# EAGLE board adapter_board (EAGLE 9.6.2), part 1 of 2
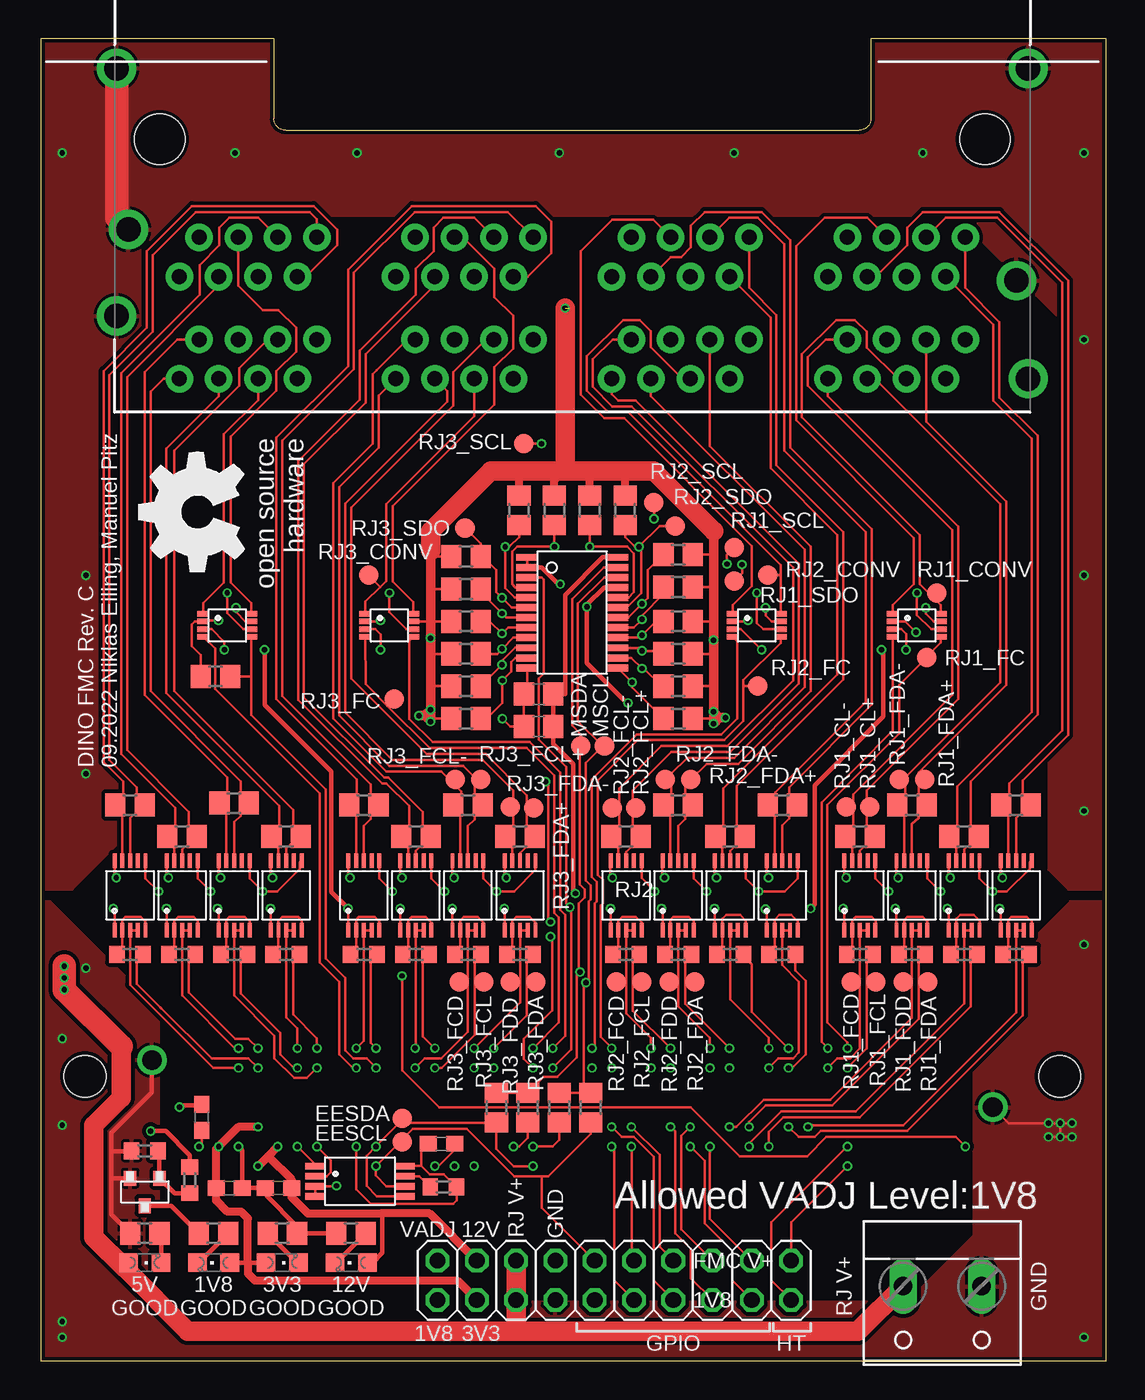
[diagram p6: board, top side]
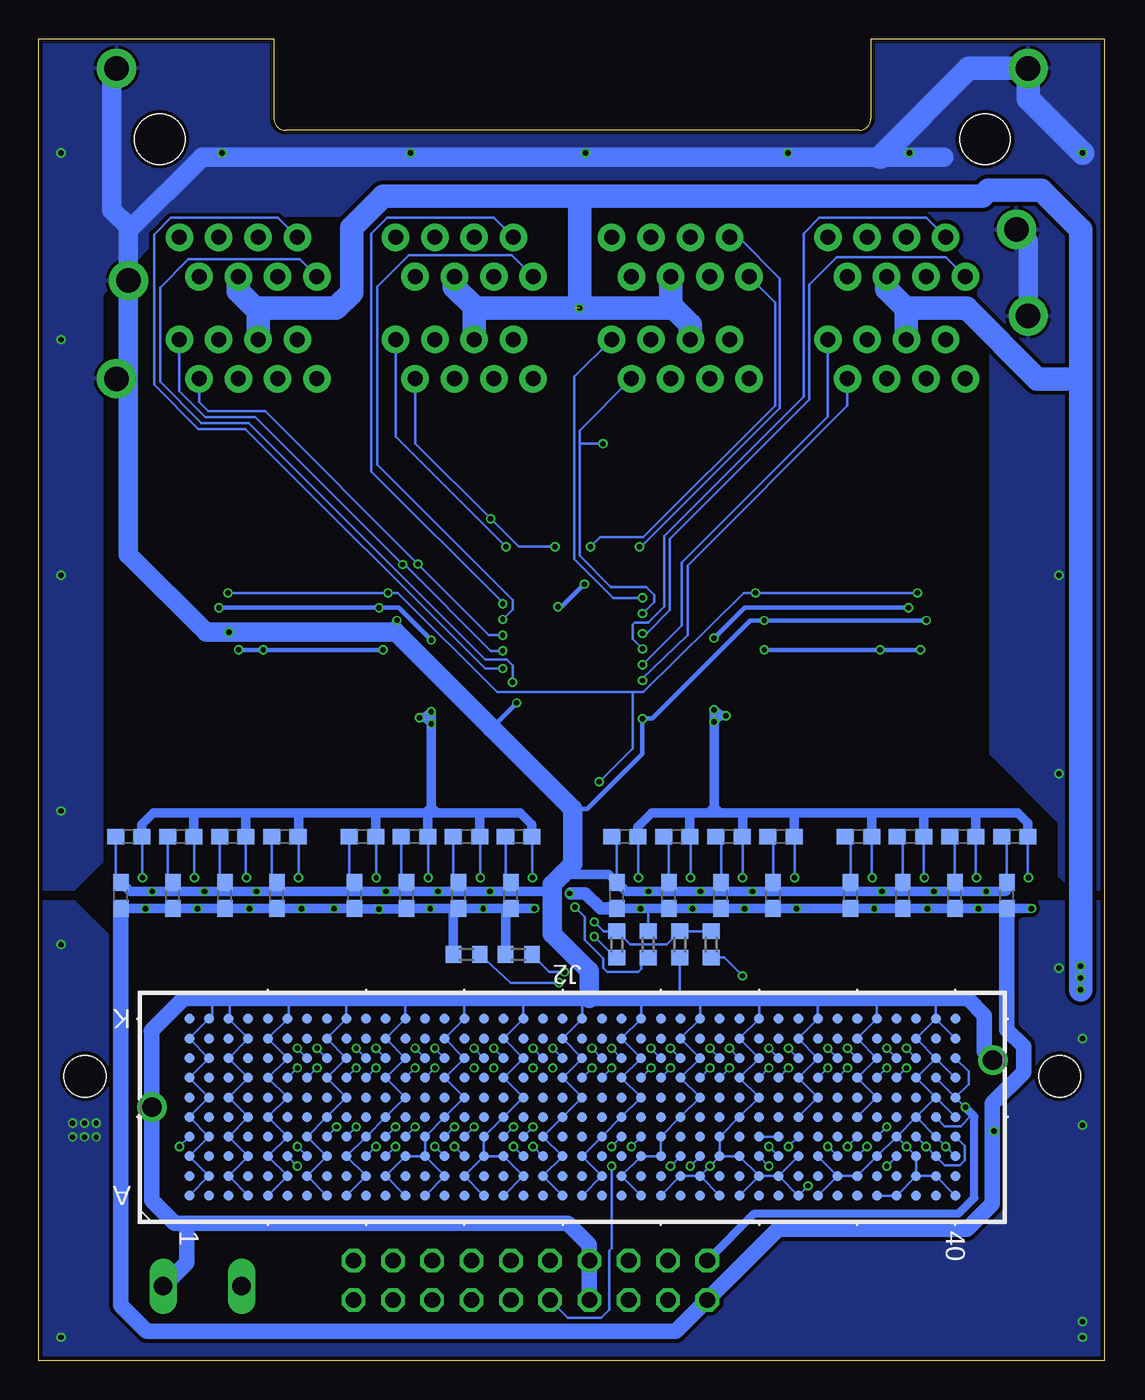
[diagram p7: board, bottom side, seen from below]

Size 68.87 x 85.5 mm. Coordinates in mm from the lower left corner, seen from the top.
Outline: 0,0 68.87,0 68.87,85.5 53.67,85.5 53.67,80.34 arc-90 52.91,79.58 15.83,79.58 arc-90 15.07,80.34 15.07,85.5 0,85.5 0,0
Copper layers (1*16): Top 0.018mm / dielectric 1.55mm / Bottom 0.018mm
Design rules "eC_2Layer_PClass6_BaseCopperO18_eCDefault": minimum track width 0.15mm, minimum drill 0.35mm, track to track 0.15mm, track to pad 0.15mm, pad to pad 0.15mm, via to via 0.15mm, smd to smd 0mil, copper to edge 0.25mm, drill to drill 0.35mm, minimum pad ring 0.175mm, minimum via ring 0.125mm, stop-mask expansion 0mil, vias tented up to drill 0.45mm, thermal gap 0.2mm
Net classes: 3 FPGA: clearance 0.152 mm to class 0, clearance 7.112 mm to class 1, clearance 3.785 mm to class 2, clearance 0.152 mm
Holes 2.7 mm at 2.87,18.4 65.87,18.4

## Footprints (pad centres in the part's own frame; a part is rotated, then mirrored left to right if it is on the bottom)
CHIPLED_0805 = smd 1.2 x 1.2: A 0,-1.05; C 0,1.05
C0603 = smd 1.1 x 1: 1 -0.85,0; 2 0.85,0
C0805 = smd 1.3 x 1.5: 1 -0.95,0; 2 0.95,0
B1,27 = smd 1.27 x 1.27: TP 0,0
TSSOP-8 = smd 1.3 x 0.4: 1 -2.9,0.975; 2 -2.9,0.325; 3 -2.9,-0.325; 4 -2.9,-0.975; 5 2.9,-0.975; 6 2.9,-0.325; 7 2.9,0.325; 8 2.9,0.975
TE_5569262-1 = drill 1.575 pad 2.54: 1 -29.464,15.49; 2 -28.702,9.144; 3 -29.464,-4.572; 4 29.464,11.43; 5 28.702,5.842; 6 29.464,-4.572 | drill 0.97 pad 1.778: 1.1 -16.51,15.49; 1.2 -17.78,12.95; 1.3 -19.05,15.49; 1.4 -20.32,12.95; 1.5 -21.59,15.49; 1.6 -22.86,12.95; 1.8 -25.4,12.95; 2.1 -2.54,15.49; 2.2 -3.81,12.95; 2.3 -5.08,15.49; 2.4 -6.35,12.95; 2.5 -7.62,15.49; 2.6 -8.89,12.95; 2.7 -10.16,15.49; 2.8 -11.43,12.95; 3.1 11.43,15.49; 3.2 10.16,12.95; 3.3 8.89,15.49; 3.4 7.62,12.95; 3.5 6.35,15.49; 3.6 5.08,12.95; 3.7 3.81,15.49; 3.8 2.54,12.95; 4.1 25.4,15.49; 4.2 24.13,12.95; 4.3 22.86,15.49; 4.4 21.59,12.95; 4.5 20.32,15.49; 4.6 19.05,12.95; 4.7 17.78,15.49; 4.8 16.51,12.95; 5.1 -16.51,8.89; 5.2 -17.78,6.35; 5.3 -19.05,8.89; 5.4 -20.32,6.35; 5.5 -21.59,8.89; 5.6 -22.86,6.35; 5.7 -24.13,8.89; 5.8 -25.4,6.35; 6.1 -2.54,8.89; 6.2 -3.81,6.35; 6.3 -5.08,8.89; 6.4 -6.35,6.35; 6.5 -7.62,8.89; 6.6 -8.89,6.35; 6.7 -10.16,8.89; 6.8 -11.43,6.35; 7.1 11.43,8.89; 7.2 10.16,6.35; 7.3 8.89,8.89; 7.4 7.62,6.35; 7.5 6.35,8.89; 7.6 5.08,6.35; 7.7 3.81,8.89; 7.8 2.54,6.35; 8.1 25.4,8.89; 8.2 24.13,6.35; 8.3 22.86,8.89; 8.4 21.59,6.35; 8.5 20.32,8.89; 8.6 19.05,6.35; 8.7 17.78,8.89; 8.8 16.51,6.35 | drill 0.965 pad 1.778: 1.7 -24.13,15.49 | hole 3.251: -26.67,0; 26.67,0
CONN_ASP-134488-01_SAI = drill 1.27 pad 1.27: 401 -27.178,-3.048; 402 27.178,0 | smd 0.635 x 0.635: A1 24.765,5.715; A2 23.495,5.715; A3 22.225,5.715; A4 20.955,5.715; A5 19.685,5.715; A6 18.415,5.715; A7 17.145,5.715; A8 15.875,5.715; A9 14.605,5.715; A10 13.335,5.715; A11 12.065,5.715; A12 10.795,5.715; A13 9.525,5.715; A14 8.255,5.715; A15 6.985,5.715; A16 5.715,5.715; A17 4.445,5.715; A18 3.175,5.715; A19 1.905,5.715; A20 0.635,5.715; A21 -0.635,5.715; A22 -1.905,5.715; A23 -3.175,5.715; A24 -4.445,5.715; A25 -5.715,5.715; A26 -6.985,5.715; A27 -8.255,5.715; A28 -9.525,5.715; A29 -10.795,5.715; A30 -12.065,5.715; A31 -13.335,5.715; A32 -14.605,5.715; A33 -15.875,5.715; A34 -17.145,5.715; A35 -18.415,5.715; A36 -19.685,5.715; A37 -20.955,5.715; A38 -22.225,5.715; A39 -23.495,5.715; A40 -24.765,5.715; B1 24.765,4.445; B2 23.495,4.445; B3 22.225,4.445; B4 20.955,4.445; B5 19.685,4.445; B6 18.415,4.445; B7 17.145,4.445; B8 15.875,4.445; B9 14.605,4.445; B10 13.335,4.445; B11 12.065,4.445; B12 10.795,4.445; B13 9.525,4.445; B14 8.255,4.445; B15 6.985,4.445; B16 5.715,4.445; B17 4.445,4.445; B18 3.175,4.445; B19 1.905,4.445; B20 0.635,4.445; B21 -0.635,4.445; B22 -1.905,4.445; B23 -3.175,4.445; B24 -4.445,4.445; B25 -5.715,4.445; B26 -6.985,4.445; B27 -8.255,4.445; B28 -9.525,4.445; B29 -10.795,4.445; B30 -12.065,4.445; B31 -13.335,4.445; B32 -14.605,4.445; B33 -15.875,4.445; B34 -17.145,4.445; B35 -18.415,4.445; B36 -19.685,4.445; B37 -20.955,4.445; B38 -22.225,4.445; B39 -23.495,4.445; B40 -24.765,4.445; C1 24.765,3.175; C2 23.495,3.175; C3 22.225,3.175; C4 20.955,3.175; C5 19.685,3.175; C6 18.415,3.175; C7 17.145,3.175; C8 15.875,3.175; C9 14.605,3.175; C10 13.335,3.175; C11 12.065,3.175; C12 10.795,3.175; C13 9.525,3.175; C14 8.255,3.175; C15 6.985,3.175; C16 5.715,3.175; C17 4.445,3.175; C18 3.175,3.175; C19 1.905,3.175; C20 0.635,3.175; C21 -0.635,3.175; C22 -1.905,3.175; C23 -3.175,3.175; C24 -4.445,3.175; C25 -5.715,3.175; C26 -6.985,3.175; C27 -8.255,3.175; C28 -9.525,3.175; C29 -10.795,3.175; C30 -12.065,3.175; C31 -13.335,3.175; C32 -14.605,3.175; C33 -15.875,3.175; C34 -17.145,3.175; C35 -18.415,3.175; C36 -19.685,3.175; C37 -20.955,3.175; C38 -22.225,3.175; C39 -23.495,3.175; C40 -24.765,3.175; D1 24.765,1.905; D2 23.495,1.905; D3 22.225,1.905; D4 20.955,1.905; D5 19.685,1.905; D6 18.415,1.905; D7 17.145,1.905; D8 15.875,1.905; D9 14.605,1.905; D10 13.335,1.905; D11 12.065,1.905; D12 10.795,1.905; D13 9.525,1.905; D14 8.255,1.905; D15 6.985,1.905; D16 5.715,1.905; D17 4.445,1.905; D18 3.175,1.905; D19 1.905,1.905; D20 0.635,1.905; D21 -0.635,1.905; D22 -1.905,1.905; D23 -3.175,1.905; D24 -4.445,1.905; D25 -5.715,1.905; D26 -6.985,1.905; D27 -8.255,1.905; D28 -9.525,1.905; D29 -10.795,1.905; D30 -12.065,1.905; D31 -13.335,1.905; D32 -14.605,1.905; D33 -15.875,1.905; D34 -17.145,1.905; D35 -18.415,1.905; D36 -19.685,1.905; D37 -20.955,1.905; D38 -22.225,1.905; D39 -23.495,1.905; D40 -24.765,1.905; E1 24.765,0.635; E2 23.495,0.635; E3 22.225,0.635; E4 20.955,0.635; E5 19.685,0.635; E6 18.415,0.635; E7 17.145,0.635; E8 15.875,0.635; E9 14.605,0.635; E10 13.335,0.635; E11 12.065,0.635; E12 10.795,0.635; E13 9.525,0.635; E14 8.255,0.635; E15 6.985,0.635; E16 5.715,0.635; E17 4.445,0.635; E18 3.175,0.635; E19 1.905,0.635; E20 0.635,0.635; E21 -0.635,0.635; E22 -1.905,0.635; E23 -3.175,0.635; E24 -4.445,0.635; E25 -5.715,0.635; E26 -6.985,0.635; E27 -8.255,0.635; E28 -9.525,0.635; E29 -10.795,0.635; E30 -12.065,0.635; E31 -13.335,0.635; E32 -14.605,0.635; E33 -15.875,0.635; E34 -17.145,0.635; E35 -18.415,0.635; E36 -19.685,0.635; E37 -20.955,0.635; E38 -22.225,0.635; E39 -23.495,0.635; E40 -24.765,0.635; F1 24.765,-0.635; F2 23.495,-0.635; F3 22.225,-0.635; F4 20.955,-0.635; F5 19.685,-0.635; F6 18.415,-0.635; F7 17.145,-0.635; F8 15.875,-0.635; F9 14.605,-0.635; F10 13.335,-0.635; F11 12.065,-0.635; F12 10.795,-0.635; F13 9.525,-0.635; F14 8.255,-0.635; F15 6.985,-0.635; F16 5.715,-0.635; F17 4.445,-0.635; F18 3.175,-0.635; F19 1.905,-0.635; F20 0.635,-0.635; F21 -0.635,-0.635; F22 -1.905,-0.635; F23 -3.175,-0.635; F24 -4.445,-0.635; F25 -5.715,-0.635; F26 -6.985,-0.635; F27 -8.255,-0.635; F28 -9.525,-0.635; F29 -10.795,-0.635; F30 -12.065,-0.635; F31 -13.335,-0.635; F32 -14.605,-0.635; F33 -15.875,-0.635; F34 -17.145,-0.635; F35 -18.415,-0.635; F36 -19.685,-0.635; F37 -20.955,-0.635; F38 -22.225,-0.635; F39 -23.495,-0.635; F40 -24.765,-0.635; G1 24.765,-1.905; G2 23.495,-1.905; G3 22.225,-1.905; G4 20.955,-1.905; G5 19.685,-1.905; G6 18.415,-1.905; G7 17.145,-1.905; G8 15.875,-1.905; G9 14.605,-1.905; G10 13.335,-1.905; G11 12.065,-1.905; G12 10.795,-1.905; G13 9.525,-1.905; G14 8.255,-1.905; G15 6.985,-1.905; G16 5.715,-1.905; G17 4.445,-1.905; G18 3.175,-1.905; G19 1.905,-1.905; G20 0.635,-1.905; G21 -0.635,-1.905; G22 -1.905,-1.905; G23 -3.175,-1.905; G24 -4.445,-1.905; G25 -5.715,-1.905; G26 -6.985,-1.905; G27 -8.255,-1.905; G28 -9.525,-1.905; G29 -10.795,-1.905; G30 -12.065,-1.905; G31 -13.335,-1.905; G32 -14.605,-1.905; G33 -15.875,-1.905; G34 -17.145,-1.905; G35 -18.415,-1.905; G36 -19.685,-1.905; G37 -20.955,-1.905; G38 -22.225,-1.905; G39 -23.495,-1.905; G40 -24.765,-1.905; H1 24.765,-3.175; H2 23.495,-3.175; H3 22.225,-3.175; H4 20.955,-3.175; H5 19.685,-3.175; H6 18.415,-3.175; H7 17.145,-3.175; H8 15.875,-3.175; H9 14.605,-3.175; H10 13.335,-3.175; H11 12.065,-3.175; H12 10.795,-3.175; H13 9.525,-3.175; H14 8.255,-3.175; H15 6.985,-3.175; H16 5.715,-3.175; H17 4.445,-3.175; H18 3.175,-3.175; H19 1.905,-3.175; H20 0.635,-3.175; H21 -0.635,-3.175; H22 -1.905,-3.175; H23 -3.175,-3.175; H24 -4.445,-3.175; H25 -5.715,-3.175; H26 -6.985,-3.175; H27 -8.255,-3.175; H28 -9.525,-3.175; H29 -10.795,-3.175; H30 -12.065,-3.175; H31 -13.335,-3.175; H32 -14.605,-3.175; H33 -15.875,-3.175; H34 -17.145,-3.175; H35 -18.415,-3.175; H36 -19.685,-3.175; H37 -20.955,-3.175; H38 -22.225,-3.175; H39 -23.495,-3.175; H40 -24.765,-3.175; J1 24.765,-4.445; J2 23.495,-4.445; J3 22.225,-4.445; J4 20.955,-4.445; J5 19.685,-4.445; J6 18.415,-4.445; J7 17.145,-4.445; J8 15.875,-4.445; J9 14.605,-4.445; J10 13.335,-4.445; J11 12.065,-4.445; J12 10.795,-4.445; J13 9.525,-4.445; J14 8.255,-4.445; J15 6.985,-4.445; J16 5.715,-4.445; J17 4.445,-4.445; J18 3.175,-4.445; J19 1.905,-4.445; J20 0.635,-4.445; J21 -0.635,-4.445; J22 -1.905,-4.445; J23 -3.175,-4.445; J24 -4.445,-4.445; J25 -5.715,-4.445; J26 -6.985,-4.445; J27 -8.255,-4.445; J28 -9.525,-4.445; J29 -10.795,-4.445; J30 -12.065,-4.445; J31 -13.335,-4.445; J32 -14.605,-4.445; J33 -15.875,-4.445; J34 -17.145,-4.445; J35 -18.415,-4.445; J36 -19.685,-4.445; J37 -20.955,-4.445; J38 -22.225,-4.445; J39 -23.495,-4.445; J40 -24.765,-4.445; K1 24.765,-5.715; K2 23.495,-5.715; K3 22.225,-5.715; K4 20.955,-5.715; K5 19.685,-5.715; K6 18.415,-5.715; K7 17.145,-5.715; K8 15.875,-5.715; K9 14.605,-5.715; K10 13.335,-5.715; K11 12.065,-5.715; K12 10.795,-5.715; K13 9.525,-5.715; K14 8.255,-5.715; K15 6.985,-5.715; K16 5.715,-5.715; K17 4.445,-5.715; K18 3.175,-5.715; K19 1.905,-5.715; K20 0.635,-5.715; K21 -0.635,-5.715; K22 -1.905,-5.715; K23 -3.175,-5.715; K24 -4.445,-5.715; K25 -5.715,-5.715; K26 -6.985,-5.715; K27 -8.255,-5.715; K28 -9.525,-5.715; K29 -10.795,-5.715; K30 -12.065,-5.715; K31 -13.335,-5.715; K32 -14.605,-5.715; K33 -15.875,-5.715; K34 -17.145,-5.715; K35 -18.415,-5.715; K36 -19.685,-5.715; K37 -20.955,-5.715; K38 -22.225,-5.715; K39 -23.495,-5.715; K40 -24.765,-5.715
2X10 = drill 1.016 octagon: 1 -11.43,-1.27; 2 -11.43,1.27; 3 -8.89,-1.27; 4 -8.89,1.27; 5 -6.35,-1.27; 6 -6.35,1.27; 7 -3.81,-1.27; 8 -3.81,1.27; 9 -1.27,-1.27; 10 -1.27,1.27; 11 1.27,-1.27; 12 1.27,1.27; 13 3.81,-1.27; 14 3.81,1.27; 15 6.35,-1.27; 16 6.35,1.27; 17 8.89,-1.27; 18 8.89,1.27; 19 11.43,-1.27; 20 11.43,1.27
R0805 = smd 1.3 x 1.5: 1 -0.95,0; 2 0.95,0
R0603 = smd 1 x 1.1: 1 -0.85,0; 2 0.85,0
MSOP-10 = smd 0.3 x 0.9: P0 -1,-2.25; P1 -0.5,-2.25; P2 0,-2.25; P3 0.5,-2.25; P4 1,-2.25; P5 1,2.25; P6 0.5,2.25; P7 0,2.25; P8 -0.5,2.25; P9 -1,2.25
PCA9548 = smd 1.5 x 0.45: P0 -2.9,3.575; P1 -2.9,2.925; P2 -2.9,2.275; P3 -2.9,1.625; P4 -2.9,0.975; P5 -2.9,0.325; P6 -2.9,-0.325; P7 -2.9,-0.975; P8 -2.9,-1.625; P9 -2.9,-2.275; P10 -2.9,-2.925; P11 -2.9,-3.575; P12 2.9,-3.575; P13 2.9,-2.925; P14 2.9,-2.275; P15 2.9,-1.625; P16 2.9,-0.975; P17 2.9,-0.325; P18 2.9,0.325; P19 2.9,0.975; P20 2.9,1.625; P21 2.9,2.275; P22 2.9,2.925; P23 2.9,3.575
VSSOP-8 = smd 0.8 x 0.3: 1 -1.55,0.75; 2 -1.55,0.25; 3 -1.55,-0.25; 4 -1.55,-0.75; 5 1.55,-0.75; 6 1.55,-0.25; 7 1.55,0.25; 8 1.55,0.75
SOT23-IRLML = smd 0.802 x 0.972: P1 -0.95,-0.885; P2 0.95,-0.885; P3 0,0.885
W237-132 = drill 1.194 long: 1 -2.54,-0.635; 2 2.54,-0.635

## Placement (x,y rotation side)
1V8_GOOD  [CHIPLED_0805]  11.18,6.35 90 top
3V3_GOOD  [CHIPLED_0805]  15.62,6.35 270 top
5V_GOOD  [CHIPLED_0805]  6.73,6.35 270 top
12V_GOOD  [CHIPLED_0805]  20.07,6.35 90 top
C1  100n  [C0603]  6.29,30.1 90 bottom
C2  100n  [C0603]  5.78,33.91 180 bottom
C3  100n  [C0805]  32.19,41.02 0 top
C4  1u  [C0805]  32.19,43.12 0 top
C5  100n  [C0603]  9.65,30.1 90 bottom
C6  100n  [C0603]  9.14,33.91 180 bottom
C7  100n  [C0603]  13.02,30.1 90 bottom
C8  100n  [C0603]  12.51,33.91 180 bottom
C9  100n  [C0603]  16.38,30.1 90 bottom
C10  100n  [C0603]  15.87,33.91 180 bottom
C11  100n  [C0603]  21.4,30.1 90 bottom
C12  100n  [C0603]  20.89,33.91 180 bottom
C13  100n  [C0603]  24.77,30.1 90 bottom
C14  100n  [C0603]  24.26,33.91 180 bottom
C15  100n  [C0603]  31.5,30.1 90 bottom
C16  100n  [C0603]  27.62,33.91 180 bottom
C17  100n  [C0603]  28.13,30.1 90 bottom
C18  100n  [C0603]  30.99,33.91 180 bottom
C19  100n  [C0603]  38.35,30.1 90 bottom
C20  100n  [C0603]  37.85,33.91 180 bottom
C21  100n  [C0603]  41.72,30.1 90 bottom
C22  100n  [C0603]  41.21,33.91 180 bottom
C23  100n  [C0603]  45.09,30.1 90 bottom
C24  100n  [C0603]  44.58,33.91 180 bottom
C25  100n  [C0603]  48.45,30.1 90 bottom
C26  100n  [C0603]  47.94,33.91 180 bottom
C27  100n  [C0603]  53.47,30.1 90 bottom
C28  100n  [C0603]  52.96,33.91 180 bottom
C29  100n  [C0603]  56.83,30.1 90 bottom
C30  100n  [C0603]  56.32,33.91 180 bottom
C31  100n  [C0603]  60.2,30.1 90 bottom
C32  100n  [C0603]  59.69,33.91 180 bottom
C33  100n  [C0603]  63.56,30.1 90 bottom
C34  100n  [C0603]  63.06,33.91 180 bottom
C35  100n  [C0603]  10.41,15.75 90 top
C36  100n  [C0603]  12.19,11.18 180 top
C37  100n  [C0603]  15.37,11.18 0 top
C39  100n  [C0603]  25.91,14.03 180 top
EESCL  TPB1,27  [B1,27]  23.37,14.16 0 top
EESDA  TPB1,27  [B1,27]  23.37,15.68 0 top
IC1  M24C02  [TSSOP-8]  20.64,11.62 0 top
J1  5569262-1  [TE_5569262-1]  34.37,79 180 top
J2  ASP-134488-01  [CONN_ASP-134488-01_SAI]  34.37,16.4 180 bottom
JP1  [2X10]  37.08,5.21 0 top
MSCL  TPB1,27  [B1,27]  36.45,39.75 0 top
MSDA  TPB1,27  [B1,27]  34.92,39.75 0 top
R1  120R  [R0805]  5.78,35.94 180 top
R2  100R  [R0603]  5.78,26.29 0 top
R3  4.7k  [R0805]  33.21,54.99 90 top
R4  4.7k  [R0805]  30.92,54.99 90 top
R5  4.7k  [R0603]  37.85,26.29 180 bottom
R6  4.7k  [R0603]  41.21,26.29 180 bottom
R7  10k  [R0603]  29.46,26.92 90 bottom
R8  4.7k  [R0805]  27.5,52.01 180 top
R9  4.7k  [R0805]  27.5,49.91 180 top
R10  4.7k  [R0805]  27.5,47.82 180 top
R11  4.7k  [R0805]  27.5,45.72 180 top
R12  4.7k  [R0805]  27.5,43.62 180 top
R13  4.7k  [R0805]  27.5,41.53 180 top
R14  4.7k  [R0805]  41.21,41.53 0 top
R15  4.7k  [R0805]  41.21,43.62 0 top
R16  4.7k  [R0805]  41.21,45.72 0 top
R17  4.7k  [R0805]  41.21,47.82 0 top
R18  4.7k  [R0805]  41.21,50.04 0 top
R19  4.7k  [R0805]  41.21,52.13 0 top
R20  4.7k  [R0805]  37.78,54.99 90 top
R21  4.7k  [R0805]  35.5,54.99 90 top
R22  120R  [R0805]  9.14,33.91 180 top
R23  100R  [R0603]  9.14,26.29 0 top
R24  120R  [R0805]  12.51,36.07 180 top
R25  100R  [R0603]  12.51,26.29 0 top
R26  120R  [R0805]  15.87,33.91 180 top
R27  100R  [R0603]  15.87,26.29 0 top
R28  120R  [R0805]  20.89,35.94 180 top
R29  100R  [R0603]  20.89,26.29 0 top
R30  120R  [R0805]  24.26,33.91 180 top
R31  100R  [R0603]  24.26,26.29 0 top
R32  120R  [R0805]  27.62,35.94 180 top
R33  100R  [R0603]  27.62,26.29 0 top
R34  120R  [R0805]  30.99,33.91 180 top
R35  100R  [R0603]  30.99,26.29 0 top
R36  120R  [R0805]  37.85,33.91 180 top
R37  100R  [R0603]  37.85,26.29 0 top
R38  120R  [R0805]  41.21,35.94 180 top
R39  100R  [R0603]  41.21,26.29 0 top
R40  120R  [R0805]  44.58,33.91 180 top
R41  100R  [R0603]  44.58,26.29 0 top
R42  120R  [R0805]  47.94,35.94 180 top
R43  100R  [R0603]  47.94,26.29 0 top
R44  120R  [R0805]  52.96,33.91 180 top
R45  100R  [R0603]  52.96,26.29 0 top
R46  120R  [R0805]  56.32,35.94 180 top
R47  100R  [R0603]  56.32,26.29 0 top
R48  120R  [R0805]  59.69,33.91 180 top
R49  100R  [R0603]  59.69,26.29 0 top
R50  120R  [R0805]  63.06,35.94 180 top
R51  100R  [R0603]  63.06,26.29 0 top
R52  NB  [R0603]  26.04,11.24 0 top
R53  330R  [R0805]  6.73,8.26 0 top
R54  1k  [R0805]  20.07,8.26 0 top
R55  10k  [R0603]  27.43,26.92 90 bottom
R56  130R  [R0805]  15.62,8.26 180 top
R57  0R DNP  [R0603]  31.5,26.92 270 bottom
R58  0R  [R0603]  25.4,26.92 90 bottom
R59  DNP  [R0805]  11.3,44.26 180 top
R60  10R  [R0603]  9.65,11.68 90 top
R61  10k  [R0603]  6.73,13.59 180 top
R62  130R  [R0805]  11.18,8.26 180 top
R63  0R DNP  [R0805]  29.46,16.38 90 top
R64  0R DNP  [R0805]  35.56,16.38 90 top
R65  0R  [R0805]  31.5,16.38 270 top
R66  0R  [R0805]  33.53,16.38 270 top
RJ1_CL+  TPB1,27  [B1,27]  53.59,35.81 0 top
RJ1_CL-  TPB1,27  [B1,27]  52.07,35.81 0 top
RJ1_CONV  TPB1,27  [B1,27]  57.91,49.66 0 top
RJ1_FC  TPB1,27  [B1,27]  57.28,45.47 0 top
RJ1_FCD  TPB1,27  [B1,27]  52.39,24.51 0 top
RJ1_FCL  TPB1,27  [B1,27]  53.97,24.51 0 top
RJ1_FDA  TPB1,27  [B1,27]  57.34,24.51 0 top
RJ1_FDA+  TPB1,27  [B1,27]  57.15,37.59 0 top
RJ1_FDA-  TPB1,27  [B1,27]  55.5,37.59 0 top
RJ1_FDD  TPB1,27  [B1,27]  55.75,24.51 0 top
RJ1_SCL  TPB1,27  [B1,27]  44.83,52.58 0 top
RJ1_SDO  TPB1,27  [B1,27]  44.83,50.42 0 top
RJ2_CONV  TPB1,27  [B1,27]  46.99,50.8 0 top
RJ2_FC  TPB1,27  [B1,27]  46.35,43.62 0 top
RJ2_FCD  TPB1,27  [B1,27]  37.21,24.51 0 top
RJ2_FCL  TPB1,27  [B1,27]  38.86,24.51 0 top
RJ2_FCL+  TPB1,27  [B1,27]  38.48,35.75 0 top
RJ2_FCL-  TPB1,27  [B1,27]  36.96,35.75 90 top
RJ2_FDA  TPB1,27  [B1,27]  42.29,24.51 0 top
RJ2_FDA+  TPB1,27  [B1,27]  42.04,37.59 0 top
RJ2_FDA-  TPB1,27  [B1,27]  40.39,37.59 0 top
RJ2_FDD  TPB1,27  [B1,27]  40.64,24.51 0 top
RJ2_SCL  TPB1,27  [B1,27]  39.62,55.5 0 top
RJ2_SDO  TPB1,27  [B1,27]  41.02,53.98 0 top
RJ3_CONV  TPB1,27  [B1,27]  21.21,50.8 0 top
RJ3_FC  TPB1,27  [B1,27]  22.86,42.8 0 top
RJ3_FCD  TPB1,27  [B1,27]  27.05,24.51 0 top
RJ3_FCL  TPB1,27  [B1,27]  28.64,24.51 0 top
RJ3_FCL+  TPB1,27  [B1,27]  28.45,37.59 0 top
RJ3_FCL-  TPB1,27  [B1,27]  26.8,37.59 0 top
RJ3_FDA  TPB1,27  [B1,27]  32,24.51 0 top
RJ3_FDA+  TPB1,27  [B1,27]  31.88,35.75 0 top
RJ3_FDA-  TPB1,27  [B1,27]  30.35,35.81 0 top
RJ3_FDD  TPB1,27  [B1,27]  30.35,24.51 0 top
RJ3_SCL  TPB1,27  [B1,27]  31.24,59.31 0 top
RJ3_SDO  TPB1,27  [B1,27]  27.43,53.85 0 top
U1  ADM3066E  [MSOP-10]  5.78,30.1 0 top
U2  ADM3066E  [MSOP-10]  9.14,30.1 0 top
U3  ADM3066E  [MSOP-10]  12.51,30.1 0 top
U4  ADM3066E  [MSOP-10]  15.87,30.1 0 top
U5  ADM3066E  [MSOP-10]  20.89,30.1 0 top
U6  ADM3066E  [MSOP-10]  24.26,30.1 0 top
U7  ADM3066E  [MSOP-10]  27.62,30.1 0 top
U8  ADM3066E  [MSOP-10]  30.99,30.1 0 top
U9  ADM3066E  [MSOP-10]  37.85,30.1 0 top
U10  ADM3066E  [MSOP-10]  41.21,30.1 0 top
U11  ADM3066E  [MSOP-10]  44.58,30.1 0 top
U12  ADM3066E  [MSOP-10]  47.94,30.1 0 top
U13  ADM3066E  [MSOP-10]  52.96,30.1 0 top
U14  ADM3066E  [MSOP-10]  56.32,30.1 0 top
U15  ADM3066E  [MSOP-10]  59.69,30.1 0 top
U16  ADM3066E  [MSOP-10]  63.06,30.1 0 top
U17  TCA9548A  [PCA9548]  34.35,48.39 0 top
U18  TXS0102  [VSSOP-8]  12.06,47.56 0 top
U19  TXS0102  [VSSOP-8]  22.54,47.56 0 top
U20  TXS0102  [VSSOP-8]  46.29,47.56 0 top
U21  TXS0102  [VSSOP-8]  56.64,47.56 0 top
U40  IRLML2502  [SOT23-IRLML]  6.73,10.92 180 top
U$1  [OSHW_8MM]  10.16,54.86 90 top
X1  [W237-132]  58.29,4.19 180 top